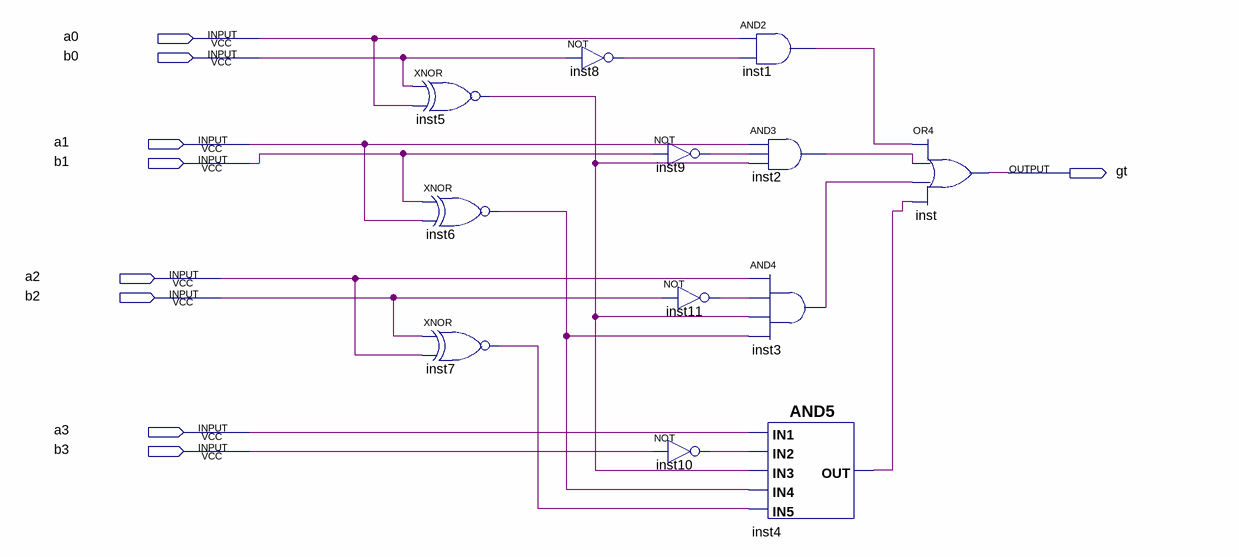
[diagram p0: schematic sheet]
// Quartus schematic gt.bdf as structural Verilog: 12 symbols, 9 pins
module gt (
  input  a0,
  input  b0,
  input  a1,
  input  b1,
  input  a2,
  input  b2,
  input  a3,
  input  b3,
  output gt
);

  wire inst1_out, inst2_out, inst3_out, inst4_out, inst5_out, inst6_out, inst7_out, inst8_out, inst9_out,
       inst10_out, inst11_out;

  xnor inst5 (inst5_out, b0, a0);
  xnor inst6 (inst6_out, b1, a1);
  xnor inst7 (inst7_out, b2, a2);
  not inst8 (inst8_out, b0);
  not inst9 (inst9_out, b1);
  not inst11 (inst11_out, b2);
  not inst10 (inst10_out, b3);
  and inst1 (inst1_out, a0, inst8_out);
  and inst2 (inst2_out, a1, inst9_out, inst5_out);
  and inst3 (inst3_out, a2, inst11_out, inst5_out, inst6_out);
  and inst4 (inst4_out, a3, inst10_out, inst5_out, inst6_out, inst7_out);
  or inst (gt, inst1_out, inst2_out, inst3_out, inst4_out);
endmodule
